# EAGLE schematic bldc_tach_schematic (EAGLE 6.2)
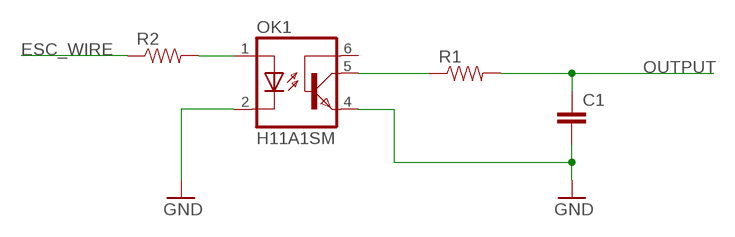
[diagram p0: schematic, sheet 1]

## Parts
C1  CAP0603-CAP  [0603-CAP]
OK1  H11A1SM  [DIL6-SMD]
R1  RESISTOR0603-RES  [0603-RES]
R2  RESISTOR0603-RES  [0603-RES]

## Nets
ESC_WIRE: R2.1
GND: C1.2 OK1.2(C) OK1.4(EMI)
N$2: OK1.5(COL) R1.1
N$4: OK1.1(A) R2.2
OUTPUT: C1.1 R1.2
Unconnected: OK1.6(BAS)

## Library data of the parts
C1 = SparkFun:CAP: Capacitor Standard 0603 ceramic capacitor, and 0.1" leaded capacitor.
OK1 = optocoupler:H11A*?M: General Purpose 6-Pin Phototransistor Optocouplers Source: http://www.fairchildsemi.com/ds/4N/4N35-M.pdf; OC_FARNELL: unknown; OC_NEWARK: unknown
R1 R2 = SparkFun:RESISTOR: Resistor Basic schematic elements and footprints for 0603, 1206, and PTH resistors.